# Altium project Datalogger.PrjPcb (part 2 of 2)

## Sheet UserInterface.SchDoc: Interface de Usuário
size A4; SheetNumber: 7; SheetTotal: 7
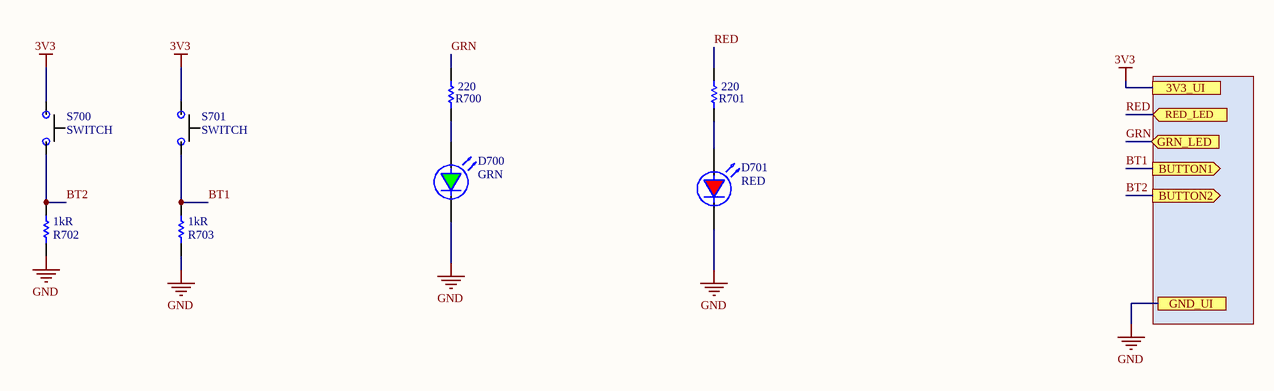
[diagram p6: UserInterface.SchDoc]

### Parts
D700  GRN  [LED-5mm-VERDE]
D701  RED  [LED-5mm-VERMELHO]
R700  Resistance (Ohms): 220  [CR2012-0805]  (hidden comment: RES 220R OHM 5% 1/8W 0805 SMD)
R701  Resistance (Ohms): 220  [CR2012-0805]  (hidden comment: RES 220R OHM 5% 1/8W 0805 SMD)
R702  Resistance: 1kR  [CR2012-0805]  (hidden comment: RES 1K OHM 1% 1/8W 0805 SMD)
R703  Resistance: 1kR  [CR2012-0805]  (hidden comment: RES 1K OHM 1% 1/8W 0805 SMD)
S700  SWITCH  [SWITCH_TACTILE_SMD_2PIN]
S701  SWITCH  [SWITCH_TACTILE_SMD_2PIN]

### Ports
3V3_UI, BUTTON1 (out), BUTTON2 (out), GND_UI, GRN_LED (in), RED_LED (in)

### Nets
3V3: S700.2 S701.2 ; port 3V3_UI
GND: D700.K D701.K R702.1 R703.2 ; port GND_UI
BT1: R703.1 S701.1 ; port BUTTON1
BT2: R702.2 S700.1 ; port BUTTON2
GRN: R700.2 ; port GRN_LED
RED: R701.2 ; port RED_LED
NetD700_A: D700.A R700.1
NetD701_A: D701.A R701.1

### Notes on the sheet
- Title:
- Drawn By:
- Page Contents:
- Checked By:
- Size:
- Date:
- File:
- License:
- Email:
- A4
- Number:
- Time:
- Revision:
- Sheet
- Website:
- of

### Library data of the parts
D700 = CMP-008-000002-1: LED GRN DIFF 5MM ROUND T/H; Manufacturer Part Number: LTL2R3KGD-EM; Manufacturer: Lite-On Inc.; Color: Green; Current - Test: 2mA; Lens Style/Size: Round with Domed Top, 5.00mm; Millicandela Rating: 38mcd; Lens Transparency: Diffused; Wavelength - Peak: 568nm; Wavelength - Dominant: 570nm; Viewing Angle: 30°; Voltage - Forward (Vf) (Typ): 1.8V; Source: mits.SchLib; Stock 1: 9370; Package / Case: Radial; Pricing 1: 1=0.33, 10=0.24, 25=0.1772, 100=0.1265, 250=0.08604, 500=0.0759, 1000=0.05946, 2500=0.05819, 5000=0.0506 (USD); Part Status: Active; Size / Dimension: -; Features: -; Packaging: Bulk; Design Item ID: LED GRN DIFF 5MM ROUND T/H; ComponentLink1URL: http://media.digikey.com/pdf/Data%20Sheets/Lite-On%20PDFs/LTL2R3KGD-EM%20Preliminary.pdf; Height (Max): 8.70mm; RoHS: RoHS Compliant; ComponentLink1Description: http://media.digikey.com/pdf/Data%20Sheets/Lite-On%20PDFs/LTL2R3KGD-EM%20Preliminary.pdf; Category: Optoelectronics; Mounting Type: Through Hole; Lens Color: Green; Supplier Device Package: T-1 3/4
D701 = CMP-008-000003-1: LED RED DIFFUSED T-1 3/4 T/H; Manufacturer: Lite-On Inc.; Wavelength: 635nm; Millicandela Rating: 19mcd; Forward Voltage: 2V; Number of Elements: 1; Dominant Wavelength: 623nm; Power Dissipation: 100mW; Current - Test: 10mA; Lens Style: Dome,Diffused,Colored,Circular; Viewing Angle: 36°; Forward Current: 30mA; Reverse Voltage: 5V; Voltage: 3V; Current: 60mA; Lens Style/Size: Round with Domed Top, 5mm (T-1 3/4), 5.00mm; Lens Color: Red; Design Item ID: LED RED DIFF 5MM ROUND T/H; Mounting Type: Through Hole; Lens Transparency: Diffused; Depth: 5.6mm; ComponentLink1URL: http://media.digikey.com/pdf/Data%20Sheets/Lite-On%20PDFs/LTL-4223.pdf; ComponentLink2Description: https://datasheet.ciiva.com/2112/ltl-4223-2112280.pdf?src-supplier=Digi-Key; Stock 2: 9769; ComponentLink3Description: https://datasheet.ciiva.com/16205/lite-on20ltl-4223-16205594.pdf?src-supplier=Future+Electronics; Pricing 2: 1=0,12000, 10=0,08000, 100=0,07100, 1000=0,06400, 2500=0,05600, 10000=0,05000 (USD); Category: Optoelectronics; Stock 1: 32305; Size / Dimension: -; Height: 8.6mm; Lead Free: Lead Free; Height (Max): 8.60mm; Color: Red; Voltage - Forward (Vf) (Typ): 2V; Min Operating Temperature: -55°C; Wavelength - Peak: 635nm; Width: 5.6mm; Supplier Device Package: T-1 3/4; Pricing 1: 1=0.36, 10=0.262, 25=0.1932, 100=0.138, 250=0.09384, 500=0.0828, 1000=0.06486, 2500=0.06348, 5000=0.0552 (USD); RoHS: RoHS Compliant; Mount: Through Hole; Wavelength - Dominant: 623nm; ComponentLink1Description: http://media.digikey.com/pdf/Data%20Sheets/Lite-On%20PDFs/LTL-4223.pdf; Number of Pins: 2; Packaging: Bulk; Number of LEDs: 1; Diameter: 5mm; Illumination Color: Red; Package Quantity: 1000; Part Status: Active; Power Rating: 100mW; Length: 5.6mm; Package / Case: Radial; Luminous Intensity: 19mcd; ComponentLink4Description: https://datasheet.ciiva.com/19482/697602-19482428.pdf?src-supplier=Jameco; Max Power Dissipation: 100mW; Features: -; ComponentLink4URL: https://datasheet.ciiva.com/19482/697602-19482428.pdf?src-supplier=Jameco; Case/Package: Radial; Max Operating Temperature: 100°C; Radiation Hardening: No; ComponentLink3URL: https://datasheet.ciiva.com/16205/lite-on20ltl-4223-16205594.pdf?src-supplier=Future+Electronics; Source: mits.SchLib; Test Current: 10mA; Manufacturer Part Number: LTL-4223; ComponentLink2URL: https://datasheet.ciiva.com/2112/ltl-4223-2112280.pdf?src-supplier=Digi-Key
R700 R701 = CMP-018-000057-1: RES SMD 220 OHM 5% 1/8W 0805; Manufacturer: Panasonic Electronic Components; Manufacturer Part Number: ERJ-6GEYJ221V; Temperature Coefficient: ±200ppm/°C; Power (Watts): 0.125W, 1/8W; Manufacturer Part Number 2: 0805W8F2200T5E; Pricing 1: 1=0.1, 10=0.025, 25=0.018, 50=0.0136, 100=0.01, 250=0.00764, 500=0.00612, 1000=0.00451 (USD); Size / Dimension: 0.079" L x 0.049" W (2.00mm x 1.25mm); Packaging: Cut Tape (CT); Composition: Thick Film; Pricing 2: 0.0034; ComponentLink1Description: http://industrial.panasonic.com/www-cgi/jvcr13pz.cgi?E+PZ+3+AOA0001+ERJ6GEYJ221V+7+WW; Category: Resistors; ComponentLink1URL: http://industrial.panasonic.com/www-cgi/jvcr13pz.cgi?E+PZ+3+AOA0001+ERJ6GEYJ221V+7+WW; Design Item ID: RES 220R OHM 5% 1/8W 0805 SMD; Failure Rate: -; Manufacturer 2: UNI-ROYAL(Uniroyal Elec); Source: mits.SchLib; RoHS: RoHS Compliant; Features: Automotive AEC-Q200; Tolerance: ±5%; Part Status: Active; Supplier Device Package: 0805; Height - Seated (Max): 0.028" (0.70mm); Operating Temperature: -55°C ~ 155°C; Stock 1: 118007; Package / Case: 0805 (2012 Metric)
R702 R703 = CMP-018-000026-1: RES SMD 1K OHM 1% 1/8W 0805; Manufacturer Part Number: RC0805FR-071KL; Manufacturer: Yageo; Voltage Rating: 150V; Temperature Coefficient: 100ppm/°C; Power Rating: 125mW; Pricing 1: 1=0,10000, 10=0,04000, 100=0,01630, 1000=0,00731, 2500=0,00635 (USD); ComponentLink2URL: https://datasheet.ciiva.com/2456/pyu-r-int-thick-7-2456976.pdf?src-supplier=Digi-Key; ComponentLink2Description: https://datasheet.ciiva.com/2456/pyu-r-int-thick-7-2456976.pdf?src-supplier=Digi-Key; RoHS: Yes; Category: Chip SMD Resistors; ComponentLink1Description: http://media.digikey.com/pdf/Data%20Sheets/Rohm%20PDFs/MCR10%20(new)%20series.pdf; ComponentLink6URL: https://datasheet.ciiva.com/46385/444164-46385020.pdf?src-supplier=Element14; Design Item ID: RES 1K OHM 1% 1/8W 0805 SMD; Number of Pins: 2; Case/Package: 0805; Stock 1: 24108233; Tolerance: 1%; Termination: SMD/SMT; Height: 0.024inch; REACH SVHC: Unknown; Military Standard: Not; Number of Terminations: 2; ComponentLink5URL: https://datasheet.ciiva.com/16850/rc0805-16850409.pdf?src-supplier=Future+Electronics; Lead Free: Lead Free; Case Code (Metric): 2012; ComponentLink3Description: https://datasheet.ciiva.com/2456/pyu-r-int-thick-7-2456977.pdf?src-supplier=Digi-Key; Package Quantity: 1; ComponentLink4Description: https://datasheet.ciiva.com/7941/1686128-7941719.pdf?src-supplier=Element14; Min Operating Temperature: -55°C; ComponentLink3URL: https://datasheet.ciiva.com/2456/pyu-r-int-thick-7-2456977.pdf?src-supplier=Digi-Key; Voltage Rating (DC): 150V; ComponentLink5Description: https://datasheet.ciiva.com/16850/rc0805-16850409.pdf?src-supplier=Future+Electronics; Composition: Thick Film; ComponentLink7URL: https://datasheet.ciiva.com/2456/pyu-r-int-thick-7-2456975.pdf?src-supplier=Digi-Key; ComponentLink4URL: https://datasheet.ciiva.com/7941/1686128-7941719.pdf?src-supplier=Element14; Source: mits.SchLib; Max Operating Temperature: 155°C; ComponentLink7Description: https://datasheet.ciiva.com/2456/pyu-r-int-thick-7-2456975.pdf?src-supplier=Digi-Key; Max Power Dissipation: 125mW; Packaging: Tape and Reel; ComponentLink6Description: https://datasheet.ciiva.com/46385/444164-46385020.pdf?src-supplier=Element14; Case Code (Imperial): 0805; Length: 0.079inch; Depth: 1.25mm; Width: 0.049inch; ComponentLink1URL: http://media.digikey.com/pdf/Data%20Sheets/Rohm%20PDFs/MCR10%20(new)%20series.pdf; Features: Moisture Resistant
S700 S701 = CMP-019-000011-1: Switch Tactile N.O. SPST Rectangular Button J-Lead 0.05A 12VDC 2.55N SMD T/R; Manufacturer Part Number: TL3302BF260QJ; Manufacturer: E-Switch; Current Rating: 50mA; Voltage Rating (DC): 12V; Operating Force: 260gf; Switch Travel: 0.25mm; Switch Function: Off-Mom; Actuator Material: Polyphenylene; Mechanical Life: 30000Cycles; Illumination Type: Non-Illuminated; ComponentLink1URL: https://datasheet.ciiva.com/2900/p020333b-2900880.pdf?src-supplier=Digi-Key; Design Item ID: SWITCH TACTILE SPST-NO 0.05A 12V SMD; Min Operating Temperature: -20°C; RoHS Compliant: Yes; ComponentLink1Description: https://datasheet.ciiva.com/2900/p020333b-2900880.pdf?src-supplier=Digi-Key; Size: 11.4mm; Package Quantity: 1; Contact Plating: Silver; Lead Free: Lead Free; Termination: Gull Wing; Series: TL3302; Mount: Surface Mount; RoHS: Yes; Category: Tactile Switches; Stock 1: 19576; Throw Configuration: SPST; Packaging: Tape and Reel; Pricing 1: 1=0,82000, 10=0,79300, 25=0,74120, 100=0,64360, 250=0,58564, 500=0,54294 (USD); Source: mits.SchLib; Max Operating Temperature: 70°C

## Nets that join several sheets
3V3: Controller (C200.2 C201.2 R201.2 U200.2), PowerSupply (C301.2 U300.3), TemperatureSensor (R400.2 R401.2 U400.5), LightingSensor (PR500.1), MicroSD (Q600.2), UserInterface (S700.2 S701.2)
GND: datalogger (CON100.1 CON102.1 SW100.2), Controller (9 pins), PowerSupply (5 pins), TemperatureSensor (U400.2), LightingSensor (R500.1), MicroSD (MICRO_SD600.6), UserInterface (D700.K D701.K R702.1 R703.2)
VCC_BAT: datalogger (CON102.2 SW100.1), PowerSupply (Q300.2)
VCC_EXT: datalogger (CON100.2), PowerSupply (F300.1)
BT1: Controller (U200.12), UserInterface (R703.1 S701.1)
BT2: Controller (U200.11), UserInterface (R702.2 S700.1)
CD: Controller (U200.22), MicroSD (MICRO_SD600.CD1)
CLK: Controller (U200.20), MicroSD (MICRO_SD600.5)
CMD: Controller (U200.19), MicroSD (MICRO_SD600.3 R602.1)
D0: Controller (U200.21), MicroSD (MICRO_SD600.7 R601.1)
D3: Controller (U200.18), MicroSD (MICRO_SD600.2 R600.1)
GRN: Controller (U200.25), UserInterface (R700.2)
LDR_DATA: Controller (U200.39), LightingSensor (PR500.2 R500.2)
RED: Controller (U200.26), UserInterface (R701.2)
RXD0: datalogger (CON101.2), Controller (U200.37)
SCL_SENSOR: Controller (U200.29), TemperatureSensor (R400.1 U400.6)
SD_EN: Controller (U200.24), MicroSD (Q600.1)
SDA_SENSOR: Controller (U200.28), TemperatureSensor (R401.1 U400.1)
TXD0: datalogger (CON101.1), Controller (U200.36)